# Altium schematic sheet power_supply.SchDoc
size A; SheetNumber: 3; SheetTotal: 3
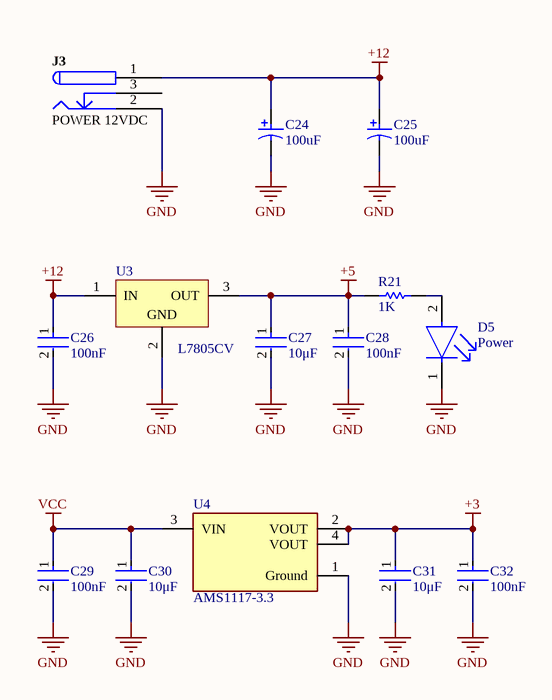
[diagram p0: power_supply.SchDoc]

## Parts
C24  100uF  [PNSC-FK-V-D8_V]
C25  100uF  [PNSC-FK-V-D8_V]
C26  100nF  [FP-0603-L_1_6_0_15-W_0_81-IPC_A]
C27  10μF  [FP-0603-L_1_6_0_15-W_0_81-IPC_A]
C28  100nF  [FP-0603-L_1_6_0_15-W_0_81-IPC_A]
C29  100nF  [FP-0603-L_1_6_0_15-W_0_81-IPC_A]
C30  10μF  [FP-0603-L_1_6_0_15-W_0_81-IPC_A]
C31  10μF  [FP-0603-L_1_6_0_15-W_0_81-IPC_A]
C32  100nF  [FP-0603-L_1_6_0_15-W_0_81-IPC_A]
D5  Power  [FP-HLMP-4700-MFG]
J3  POWER 12VDC  [KYCN-KLDX-0202-B_V]
R21  1K  [RESC1609X55X30ML15T15]
U3  L7805CV  [TO220]
U4  AMS1117-3.3  [FP-AMS1117-IPC_A]

## Nets
+3: C31.1 C32.1 U4.2(VOUT) U4.4(VOUT)
+5: C27.1 C28.1 R21.2 U3.3(OUT)
+12: C24.1 C25.1 C26.1 J3.1 U3.1(IN)
GND: C24.2 C25.2 C26.2 C27.2 C28.2 C29.2 C30.2 C31.2 C32.2 D5.1(C) J3.2 U3.2(GND) U4.1(Ground)
VCC: C29.1 C30.1 U4.3(VIN)
NetD5_2: D5.2(A) R21.1

Not connected (* = marked no-connect by the designer): J3 3

## Library data of the parts
C24 C25 = CMP-2000-06206-1: Aluminum Electrolytic Capacitor, 100 uF, +/- 20%, 25 V, 2-Pin SMD (Size Code D8), -55 to 105 degC, RoHS, Tape and Reel; Manufacturer: Panasonic; Type: Can; Lifetime@Temperature: 2000Hrs@105°C; Capacitance: 100µF; Rated Voltage: 25V; Ripple Current: 280mA; Impedance: 0.34O; Case Size/Dimension: Ø6.3x7.7mm; Operating Temp-Max: 105°C; Series: FK; Package URL: http://industrial.panasonic.com/cdbs/www-data/pdf/RDE0000/DME0000COL48.pdf; Mounting Technology: SurfaceMount; Package Description: 2-Pin Electrolytic Aluminum Capacitor, Body 6.6 x 6.6 mm; Datasheet Version: 03/2016; Datasheet URL: http://industrial.panasonic.com/cdbs/www-data/pdf/RDE0000/ABA0000C1181.pdf; Manufacturer URL: http://www.panasonic.com/; Package Reference: FK-V-D8; Operating Temp Range: -55to+105°C
C26-C32 = CMP-1035-02592-4: General Purpose Ceramic Capacitor, 0603, 100nF, 10%, X7R, 15%, 50V; Dissipation Factor: 2.5%; Radiation Hardening: No; Termination: SMD/SMT; Tolerance: 10%; Lead Free: Lead Free; Width: 0.81mm; Max Operating Temperature: 125°C; Thickness: 0.035inch; Voltage Rating: 50V; Height: 0.9mm; Case/Package: 0603; Depth: 0.81mm; Number of Pins: 2; Capacitance: 100nF; REACH SVHC: No SVHC; Case Code (Imperial): 0603; Voltage: 50V; Voltage Rating (DC): 50V; Mount: Surface Mount; Length: 1.6mm; Min Operating Temperature: -55°C; Packaging: Tape and Reel; Case Code (Metric): 1608; Dielectric Material: Ceramic; Package Quantity: 1; Dielectric: X7R; Contact Plating: Tin
D5 = CMP-18399-000008-1: LED RED DIFFUSED T-1 3/4 T/H; Manufacturer: Broadcom; Luminous Intensity: 2.3mcd; Peak Emmision Wavelength: 635nm; Forward Voltage: 1.7V; Viewing Angle: 50°; Led Orientation: Straight; Reverse Voltage: 5V; Forward Current: 2mA; Power Dissipation: 14mW; Wavelength: 626nm; Digikey Description: LED RED DIFFUSED T-1 3/4 T/H; Device Class L3: unset; Temperature Range Low: -40°C; Temperature Range High: +100°C; RoHS: TRUE; Package: HLMP-4700; Octopart: https://octopart.com/hlmp-4700-broadcom-71130526; Automotive: No; ComponentLink2URL: https://docs.broadcom.com/docs/AV02-1557EN; Colour: Red; Temperature: -40°C to +100°C; Lead Free: Yes; Category: Diode; ComponentLink2Description: Datasheet; Manufacturer Part Number: HLMP-4700; Device Class L1: Optoelectronics; Device Class L2: LEDs; Mouser Description: LED; Red; 2.3mcd; 0.24In.Dia.; T-1-3/4; 500mA; 1.7V; 635nm; 50deg; 5V; 24mW; -55degC;
J3 = CMP-0256-00001-1: 3 Conductor Power Jack, 2 break 2 aux contacts; PartNumber: KLDX-0202-B; ComponentLink2URL: http://anacapa.kycon.com/Catalog_PDF/KLDX_0202.pdf; PackageReference: KLDX-0202-B; Contact Finish: Brass; ComponentLink2Description: Datasheet; Mounting Technology: Through Hole; PackageDescription: Jack, 9 x 14.5 mm Body, 2.5 mm Center Pin Diameter; ComponentLink1Description: Manufacturer URL; ComponentLink1URL: http://kycon.com/
R21 = CMP-1012-00623-3: Chip Resistor, 10 KOhm, +/- 1%, 0.1 W, -55 to 155 degC, 0603 (1608 Metric), RoHS, Tape and Reel; Manufacturer: Panasonic; Voltage Rating: 75V; Case\/Package: 0603; Power Rating: 100mW; Resistance: 10KOhm; Temperature Coefficient: 100ppm\/degreesC; Number of Pins: 2; Package Reference: 603; Depth: 0.8mm; Mount: SurfaceMount; Package Description: 2-Pin Surface Mount Device, Body 1.6 x 0.85 mm; Datasheet Version: 02/2017; Length: 1.6mm; Lead Free: LeadFree; Height: 0.45mm; Number of Terminations: 2; Max Power Dissipation: 100mW; Min Operating Temperature: -55degC; Datasheet URL: https://industrial.panasonic.com/cdbs/www-data/pdf/RDA0000/AOA0000C304.pdf; Termination: SMD/SMT; Case Code (Metric): 1608; Case Code (Imperial): 0603; Tolerance: 1%; Max Operating Temperature: 155degC; RoHSCompliant: true; Voltage Rating (DC): 75V; Radiation Hardening: No; Packaging: TapeandReel; Composition: ThickFilm; Mounting Technology: SurfaceMount; Manufacturer URL: http://www.panasonic.com/; Width: 0.031inch; REACH SVHC: NoSVHC; Contact Plating: Tin; Military Standard: Not; Package Quantity: 1
U3 = CMP-0244-00483-1: Positive Voltage Regulator, 5V, 3-Pin TO-220; PackageDescription: TO, Thru-Hole, Vertical, Heatsink Mounted; 3 In-Line Leads; Pitch 2.54 mm; ComponentLink2Description: Datasheet; PackageReference: TO220; ComponentLink3URL: http://www.st.com/internet/com/TECHNICAL_RESOURCES/TECHNICAL_LITERATURE/PACKAGE_INFORMATION/CD00004649.pdf; DatasheetVersion: 16/11/2011; ComponentLink1Description: Manufacturer URL; ComponentLink1URL: http://www.st.com; PackageVersion: ver3.0; ComponentLink3Description: Package Specification; ComponentLink2URL: http://www.st.com/internet/com/TECHNICAL_RESOURCES/TECHNICAL_LITERATURE/DATASHEET/CD00000444.pdf
U4 = CMP-209535-000001-1: LDO Voltage Regulators 1A, 3.3V; Manufacturer: Advanced Monolithic Systems; Dropout Voltage: 1.1V; Output Type: Fixed; Nominal Supply Current: 5mA; Max Power Dissipation: 1.2W; Max Supply Voltage: 15V; Number Of Outputs: 1; Standoff Height: 0.64mm; Max Junction Temp: +125°C; Height: 1.8mm; Package: AMS1117; Device Class L2: Power Management ICs; ComponentLink2Description: Datasheet; ComponentLink2URL: http://www.advanced-monolithic.com/pdf/ds1117.pdf; Category: IC; RoHS: TRUE; Automotive: No; Device Class L1: Integrated Circuits (ICs); Output Current: 1A; Device Class L3: Voltage Regulators - Linear; Temperature: -40°C to +125°C; Output Voltage: 3.3V; Manufacturer Part Number: AMS1117-3.3; Temperature Range Low: -40°C; Octopart: https://octopart.com/ams1117-3.3-advanced+monolithic+systems-25899300; Lead Free: Yes; Ipc Land Pattern Name: SOT229P700X180-4; Temperature Range High: +125°C